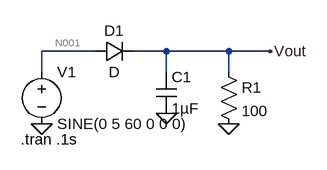
[diagram p0: schematic tut2 Q2 2c.asc]
tut2 Q2 2c.asc, the LTspice schematic file:
Version 4
SHEET 1 880 680
WIRE 96 96 16 96
WIRE 208 96 160 96
WIRE 304 96 208 96
WIRE 368 96 304 96
WIRE 16 128 16 96
WIRE 208 128 208 96
WIRE 304 128 304 96
FLAG 16 208 0
FLAG 208 192 0
FLAG 304 208 0
FLAG 368 96 Vout
SYMBOL diode 96 112 R270
WINDOW 0 32 32 VTop 2
WINDOW 3 0 32 VBottom 2
SYMATTR InstName D1
SYMBOL cap 192 128 R0
SYMATTR InstName C1
SYMATTR Value 1µF
SYMBOL res 288 112 R0
SYMATTR InstName R1
SYMATTR Value 100
SYMBOL voltage 16 112 R0
WINDOW 123 0 0 Left 2
WINDOW 39 0 0 Left 2
SYMATTR InstName V1
SYMATTR Value SINE(0 5 60 0 0 0)
TEXT -16 232 Left 2 !.tran .1s

The netlist it stands for:
* tut2 Q2 2c.asc
D1 N001 Vout D
C1 Vout 0 1µF
R1 Vout 0 100
V1 N001 0 SINE(0 5 60 0 0 0)
.model D D
.lib standard.dio
.tran .1s
.backanno
.end

* Results of the author's LTspice run, read from the files saved beside the schematic
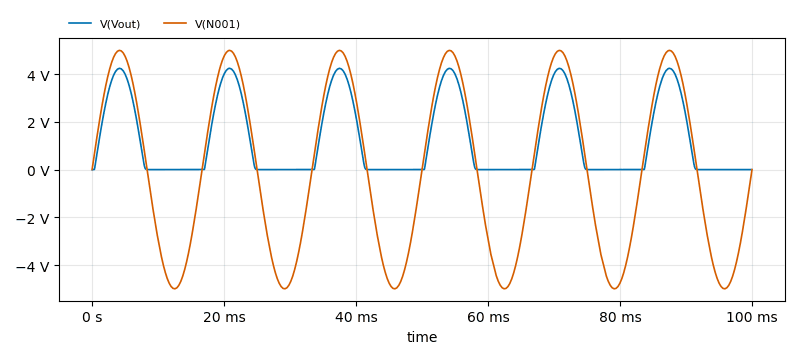
[diagram p1: Transient Analysis of tut2 Q2 2c.asc, plotted from the saved traces]
* Transient Analysis, 1 run:
*   V(Vout): min 0 V, max 4.246 V, average 1.24 V, rms 2.036 V, last 0 V
*   V(N001): min -4.997 V, max 4.998 V, average 1.374 mV, rms 3.534 V, last 0 V